# EasyEDA schematic SCH_research_roject_2023-12-18.json
TITLE: Prototype; REV: 1.0; Date: 2023-12-18; Sheet: 1/1; Drawn By: Simone; Company: Unitn
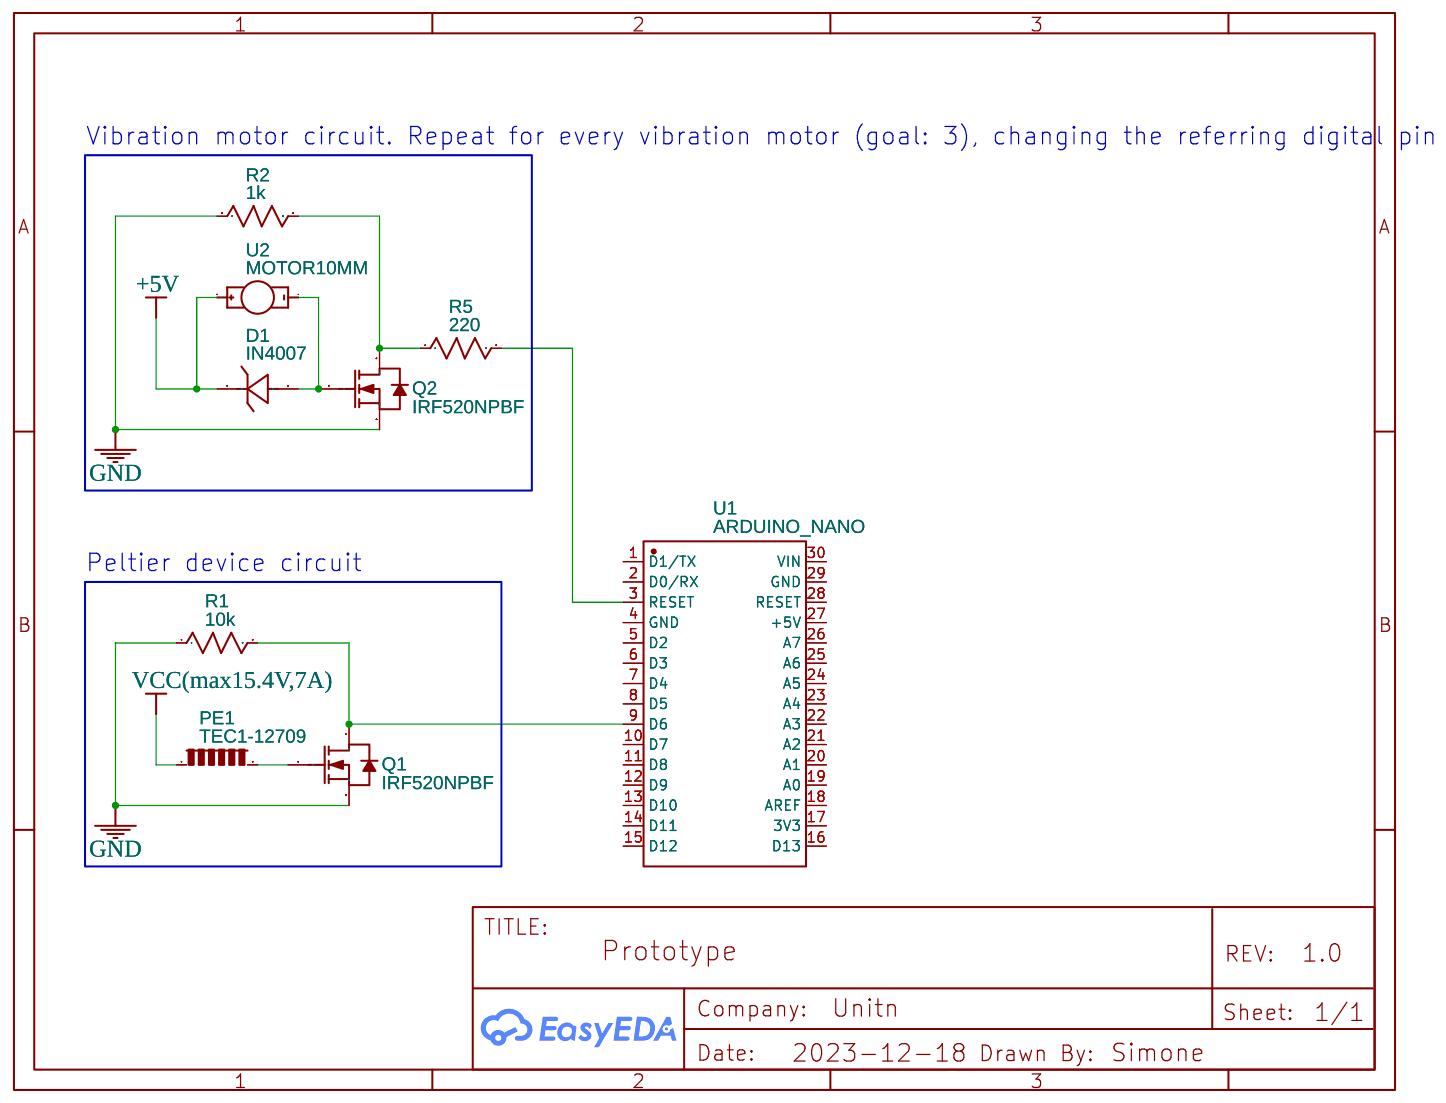
[diagram p0: schematic sheet]

## Parts
D1  IN4007  [SMA_L4.3-W2.6-LS5.1-RD]
PE1  TEC1-12709
Q1  IRF520NPBF  [TO-220-3_L10.0-W4.5-P2.54-T]
Q2  IRF520NPBF  [TO-220-3_L10.0-W4.5-P2.54-T]
R1  10k  [R0603]
R2  1k  [R0603]
R5  220  [R0603]
U1  ARDUINO_NANO  [COMM-TH_ARDUINO_NANO]
U2  MOTOR10MM  [VIBE-MOTOR-10MM]

## Library data of the parts
D1 = IN4007: Contributor: LCSC; Supplier: LCSC; Supplier Part: C9900004719; JLCPCB Part Class: Extended Part; Manufacturer: null
PE1 = Peltier_Element: Contributor: KiCAD; license: https://www.gnu.org/licenses/lgpl-2.1.html
Q1 Q2 = IRF520NPBF: Supplier: LCSC; Manufacturer: Infineon(英飞凌); Supplier Part: C2598; JLCPCB Part Class: Extended Part
R1 R2 R5 = R_0603_US: Contributor: LCEDA_Lib
U1 = ARDUINO_NANO: Contributor: lcsc; Supplier: LCSC; Supplier Part: C9900017879; Manufacturer: null; JLCPCB Part Class: Extended Part
U2 = MOTOR10MM: Vibration Motor- ROB-08449; Contributor: SparkFun

## Nets
+5V: D1.1(C) U2.+
GND: Q1.3(S) Q2.3(S) R1.1 R2.1
VCC(max15.4V,7A): PE1.1
Net-(D1-2): D1.2(A) Q2.1(G) U2.-
Net-(PE1-2): PE1.2 Q1.1(G)
Net-(Q1-2): Q1.2(D) R1.2 U1.9(D6)
Net-(Q2-2): Q2.2(D) R2.2 R5.1
Net-(R5-2): R5.2 U1.3(RESET)

Not connected (* = marked no-connect by the designer): U1 1(D1/TX) 2(D0/RX) 4(GND) 5(D2) 6(D3) 7(D4) 8(D5) 10(D7) 11(D8) 12(D9) 13(D10) 14(D11) 15(D12) 16(D13) 17(3V3) 18(AREF) 19(A0) 20(A1) 21(A2) 22(A3) 23(A4) 24(A5) 25(A6) 26(A7) 27(+5V) 28(RESET) 29(GND) 30(VIN)

## Notes on the sheet
- Vibration motor circuit. Repeat for every vibration motor (goal: 3), changing the referring digital pin
- Peltier device circuit
